# Altium schematic sheet Inverter.SchDoc
size A3 portrait; SheetNumber: 5; SheetTotal: 5
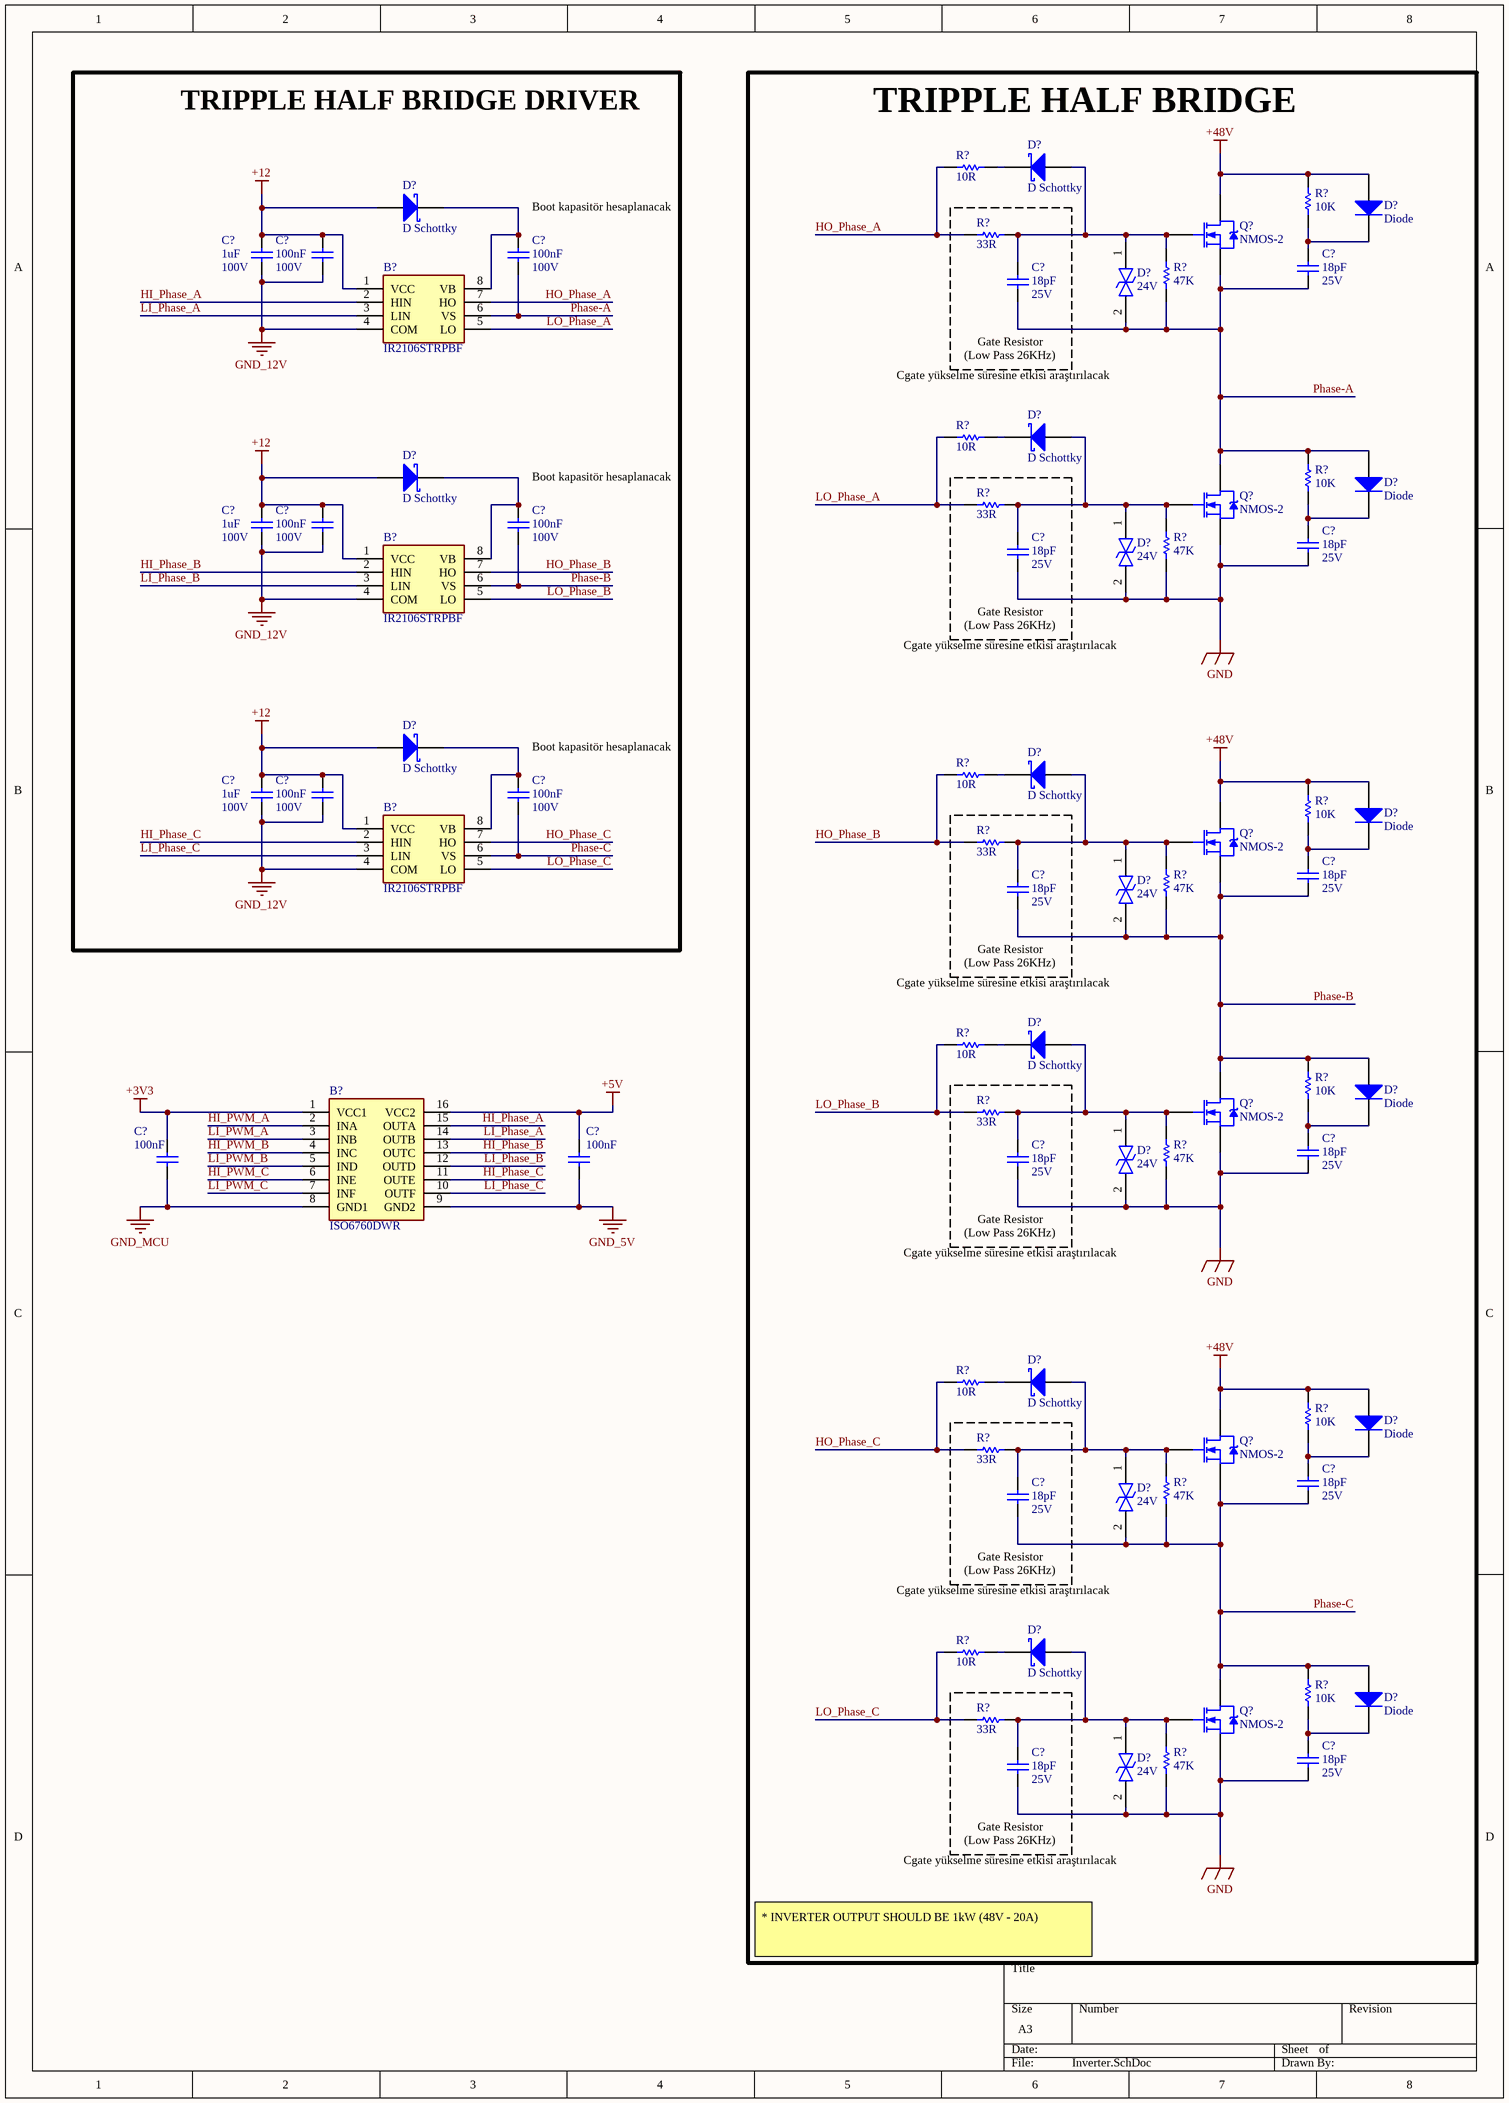
[diagram p0: Inverter.SchDoc]

## Parts
(Parts that share a designator on the sheet are numbered #1, #2 ... from top to bottom, then left to right.)
B?#1  IR2106STRPBF  [SOIC-8]
B?#2  IR2106STRPBF  [SOIC-8]
B?#3  IR2106STRPBF  [SOIC-8]
B?#4  ISO6760DWR  [SOIC-16N]
C?#1  value 1uF  Voltage: 100V  (hidden comment: Cap)
C?#2  value 100nF  Voltage: 100V  (hidden comment: Cap)
C?#3  value 100nF  Voltage: 100V  (hidden comment: Cap)
C?#4  value 18pF  Voltage: 25V  (hidden comment: Cap)
C?#5  value 18pF  Voltage: 25V  (hidden comment: Cap)
C?#6  value 1uF  Voltage: 100V  (hidden comment: Cap)
C?#7  value 100nF  Voltage: 100V  (hidden comment: Cap)
C?#8  value 100nF  Voltage: 100V  (hidden comment: Cap)
C?#9  value 18pF  Voltage: 25V  (hidden comment: Cap)
C?#10  value 18pF  Voltage: 25V  (hidden comment: Cap)
C?#11  value 1uF  Voltage: 100V  (hidden comment: Cap)
C?#12  value 100nF  Voltage: 100V  (hidden comment: Cap)
C?#13  value 100nF  Voltage: 100V  (hidden comment: Cap)
C?#14  value 18pF  Voltage: 25V  (hidden comment: Cap)
C?#15  value 18pF  Voltage: 25V  (hidden comment: Cap)
C?#16  value 18pF  Voltage: 25V  (hidden comment: Cap)
C?#17  value 100nF  (hidden comment: Cap)
C?#18  value 100nF  (hidden comment: Cap)
C?#19  value 18pF  Voltage: 25V  (hidden comment: Cap)
C?#20  value 18pF  Voltage: 25V  (hidden comment: Cap)
C?#21  value 18pF  Voltage: 25V  (hidden comment: Cap)
C?#22  value 18pF  Voltage: 25V  (hidden comment: Cap)
C?#23  value 18pF  Voltage: 25V  (hidden comment: Cap)
D?#1  D Schottky
D?#2  D Schottky
D?#3  Diode
D?#4  24V
D?#5  D Schottky
D?#6  D Schottky
D?#7  Diode
D?#8  24V
D?#9  D Schottky
D?#10  D Schottky
D?#11  Diode
D?#12  24V
D?#13  D Schottky
D?#14  Diode
D?#15  24V
D?#16  D Schottky
D?#17  Diode
D?#18  24V
D?#19  D Schottky
D?#20  Diode
D?#21  24V
Q?#1  NMOS-2
Q?#2  NMOS-2
Q?#3  NMOS-2
Q?#4  NMOS-2
Q?#5  NMOS-2
Q?#6  NMOS-2
R?#1  value 10R  (hidden comment: Res Small)
R?#2  value 10K  (hidden comment: Res Small)
R?#3  value 33R  (hidden comment: Res Small)
R?#4  value 47K  (hidden comment: Res Small)
R?#5  value 10R  (hidden comment: Res Small)
R?#6  value 10K  (hidden comment: Res Small)
R?#7  value 33R  (hidden comment: Res Small)
R?#8  value 47K  (hidden comment: Res Small)
R?#9  value 10R  (hidden comment: Res Small)
R?#10  value 10K  (hidden comment: Res Small)
R?#11  value 33R  (hidden comment: Res Small)
R?#12  value 47K  (hidden comment: Res Small)
R?#13  value 10R  (hidden comment: Res Small)
R?#14  value 10K  (hidden comment: Res Small)
R?#15  value 33R  (hidden comment: Res Small)
R?#16  value 47K  (hidden comment: Res Small)
R?#17  value 10R  (hidden comment: Res Small)
R?#18  value 10K  (hidden comment: Res Small)
R?#19  value 33R  (hidden comment: Res Small)
R?#20  value 47K  (hidden comment: Res Small)
R?#21  value 10R  (hidden comment: Res Small)
R?#22  value 10K  (hidden comment: Res Small)
R?#23  value 33R  (hidden comment: Res Small)
R?#24  value 47K  (hidden comment: Res Small)

## Blocks framed on the sheet
TRIPPLE HALF BRIDGE DRIVER: B?#1-B?#3 C?#1-C?#3 C?#6-C?#8 C?#11-C?#13 D?#2 D?#6 D?#9
TRIPPLE HALF BRIDGE: C?#4 C?#5 C?#9 C?#10 C?#14-C?#16 C?#19-C?#23 D?#1 D?#3-D?#5 D?#7 D?#8 D?#10-D?#21 Q?#1-Q?#6 R?#1-R?#24

## Nets
+3V3: B?#4.1(VCC1) C?#17.2
+5V: B?#4.16(VCC2) C?#18.2
+12: B?#1.1(VCC) B?#2.1(VCC) B?#3.1(VCC) C?#1.2 C?#2.2 C?#6.2 C?#7.2 C?#11.2 C?#12.2 D?#2.1(A) D?#6.1(A) D?#9.1(A)
+48V: D?#3.1(A) D?#11.1(A) D?#17.1(A) Q?#1.2(D) Q?#3.2(D) Q?#5.2(D) R?#2.2 R?#10.2 R?#18.2
GND: C?#9.1 C?#10.1 C?#16.1 C?#19.1 C?#22.1 C?#23.1 D?#8.2 D?#15.2 D?#21.2 Q?#2.3(S) Q?#4.3(S) Q?#6.3(S) R?#8.1 R?#16.1 R?#24.1
GND_5V: B?#4.9(GND2) C?#18.1
GND_12V: B?#1.4(COM) B?#2.4(COM) B?#3.4(COM) C?#1.1 C?#2.1 C?#6.1 C?#7.1 C?#11.1 C?#12.1
GND_MCU: B?#4.8(GND1) C?#17.1
HI_Phase_A: B?#1.2(HIN) B?#4.15(OUTA)
HI_Phase_B: B?#2.2(HIN) B?#4.13(OUTC)
HI_Phase_C: B?#3.2(HIN) B?#4.11(OUTE)
HI_PWM_A: B?#4.2(INA)
HI_PWM_B: B?#4.4(INC)
HI_PWM_C: B?#4.6(INE)
HO_Phase_A: B?#1.7(HO) R?#1.2 R?#3.2
HO_Phase_B: B?#2.7(HO) R?#9.2 R?#11.2
HO_Phase_C: B?#3.7(HO) R?#17.2 R?#19.2
LI_Phase_A: B?#1.3(LIN) B?#4.14(OUTB)
LI_Phase_B: B?#2.3(LIN) B?#4.12(OUTD)
LI_Phase_C: B?#3.3(LIN) B?#4.10(OUTF)
LI_PWM_A: B?#4.3(INB)
LI_PWM_B: B?#4.5(IND)
LI_PWM_C: B?#4.7(INF)
LO_Phase_A: B?#1.5(LO) R?#5.2 R?#7.2
LO_Phase_B: B?#2.5(LO) R?#13.2 R?#15.2
LO_Phase_C: B?#3.5(LO) R?#21.2 R?#23.2
Phase-A: B?#1.6(VS) C?#3.1 C?#4.1 C?#5.1 D?#4.2 D?#7.1(A) Q?#1.3(S) Q?#2.2(D) R?#4.1 R?#6.2
Phase-B: B?#2.6(VS) C?#8.1 C?#14.1 C?#15.1 D?#12.2 D?#14.1(A) Q?#3.3(S) Q?#4.2(D) R?#12.1 R?#14.2
Phase-C: B?#3.6(VS) C?#13.1 C?#20.1 C?#21.1 D?#18.2 D?#20.1(A) Q?#5.3(S) Q?#6.2(D) R?#20.1 R?#22.2
NetB?#1_8: B?#1.8(VB) C?#3.2 D?#2.2(K)
NetB?#2_8: B?#2.8(VB) C?#8.2 D?#6.2(K)
NetB?#3_8: B?#3.8(VB) C?#13.2 D?#9.2(K)
NetC?#4_2: C?#4.2 D?#3.2(K) R?#2.1
NetC?#5_2: C?#5.2 D?#1.1(A) D?#4.1 Q?#1.1(G) R?#3.1 R?#4.2
NetC?#9_2: C?#9.2 D?#7.2(K) R?#6.1
NetC?#10_2: C?#10.2 D?#5.1(A) D?#8.1 Q?#2.1(G) R?#7.1 R?#8.2
NetC?#14_2: C?#14.2 D?#11.2(K) R?#10.1
NetC?#15_2: C?#15.2 D?#10.1(A) D?#12.1 Q?#3.1(G) R?#11.1 R?#12.2
NetC?#16_2: C?#16.2 D?#14.2(K) R?#14.1
NetC?#19_2: C?#19.2 D?#13.1(A) D?#15.1 Q?#4.1(G) R?#15.1 R?#16.2
NetC?#20_2: C?#20.2 D?#17.2(K) R?#18.1
NetC?#21_2: C?#21.2 D?#16.1(A) D?#18.1 Q?#5.1(G) R?#19.1 R?#20.2
NetC?#22_2: C?#22.2 D?#20.2(K) R?#22.1
NetC?#23_2: C?#23.2 D?#19.1(A) D?#21.1 Q?#6.1(G) R?#23.1 R?#24.2
NetD?#1_2: D?#1.2(K) R?#1.1
NetD?#5_2: D?#5.2(K) R?#5.1
NetD?#10_2: D?#10.2(K) R?#9.1
NetD?#13_2: D?#13.2(K) R?#13.1
NetD?#16_2: D?#16.2(K) R?#17.1
NetD?#19_2: D?#19.2(K) R?#21.1

## Notes on the sheet
- (near C?#3) Boot kapasitör hesaplanacak
- (Low Pass 26KHz)
- (near C?#5) Gate Resistor
- Cgate yükselme süresine etkisi araştırılacak
- (near C?#8) Boot kapasitör hesaplanacak
- (near C?#10) Gate Resistor
- (near C?#13) Boot kapasitör hesaplanacak
- (near C?#15) Gate Resistor
- (near C?#19) Gate Resistor
- (near C?#21) Gate Resistor
- (near C?#23) Gate Resistor
- * INVERTER OUTPUT SHOULD BE 1kW (48V - 20A)

## Library data of the parts
B?#1-B?#3 = IR2106STRPBF: INFINEON - IR2106STRPBF - MOSFET Driver, 2 outputs, High Side and Low Side, 10V-20V supply, 350 mA output, SOIC-8; Geometry.Height: 1.75mm; Manufacturer_Name: Infineon; Manufacturer_Part_Number: IR2106STRPBF; Mouser Part Number: 942-IR2106STRPBF; Mouser Price/Stock: https://www.mouser.co.uk/ProductDetail/Infineon-Technologies/IR2106STRPBF?qs=2r01AXMCG3OwYry05S78qA%3D%3D; Arrow Part Number: IR2106STRPBF; Arrow Price/Stock: https://www.arrow.com/en/products/ir2106strpbf/infineon-technologies-ag?region=nac; Datasheet Link: https://www.mouser.in/datasheet/2/196/Infineon_ir2106_DS_v01_00_EN-1732317.pdf
B?#4 = ISO6760DWR: CAN, RS232, RS485, SPI Digital Isolator 5000Vrms 6 Channel 50Mbps 50kV/s CMTI 16-SOIC (0.295", 7.50mm Width)
C?#1-C?#23 = Cap: Capacitor; Published: 8-Jun-2000; LatestRevisionDate: 17-Jul-2002; LatestRevisionNote: Re-released for DXP Platform.; PackageReference: RAD-0.3; Publisher: Altium Limited; PackageDescription: Radial Cap, Thru-Hole; 2 Leads; 0.3 in Pin Spacing
D?#1 D?#2 D?#5 D?#6 D?#9 D?#10 D?#13 D?#16 D?#19 = D Schottky: Schottky Diode; Published: 8-Jun-2000; LatestRevisionDate: 17-Jul-2002; LatestRevisionNote: Re-released for DXP Platform.; PackageReference: SMB; Publisher: Altium Limited; PackageDescription: DO-214-AA/SMB; 2 C-Bend Leads; Body 5.3 x 3.6 mm, inc. leads (LxW); Code_JEDEC: DO-214-AA
D?#3 D?#7 D?#11 D?#14 D?#17 D?#20 = Diode: Default Diode; Published: 8-Jun-2000; LatestRevisionDate: 17-Jul-2002; LatestRevisionNote: Re-released for DXP Platform.; PackageVersion: Sep-1996; PackageReference: SMC; Publisher: Altium Limited; PackageDescription: DO-214-AB/SMC; 2 C-Bend Leads; Body 7.9 x 5.9 mm, inc. leads (LxW); Code_JEDEC: DO-214-AB
D?#4 D?#8 D?#12 D?#15 D?#18 D?#21 = TVS: TVS  / ESD Suppressors Diodes Bi-Directional
Q?#1-Q?#6 = NMOS-2: N-Channel Power MOSFET; Note: Pin 2 is electrically connected to pin 4.; Published: 8-Jun-2000; LatestRevisionDate: 17-Jul-2002; LatestRevisionNote: Re-released for DXP Platform.; DatasheetVersion: PD-9.814; PackageVersion: Feb-1997; PackageReference: TO-220AB; Publisher: Altium Limited; PackageDescription: TO, Thru-Hole, Vertical, Heatsink Mounted; 3 In-Line Leads; Pitch 2.54 mm; ComponentLink1Description: Manufacturer Link; ComponentLink1URL: http://www.irf.com/
R?#1-R?#24 = Res Small: Resistor; Published: 8-Jun-2000; LatestRevisionDate: 17-Jul-2002; LatestRevisionNote: Re-released for DXP Platform.; PackageReference: AXIAL-0.3; Publisher: Altium Limited; PackageDescription: Axial Device, Thru-Hole; 2 Leads; 0.3 in Pin Spacing